# Altium schematic sheet 信号发生器.SchDoc
size B; SheetNumber: 0; SheetTotal: 0
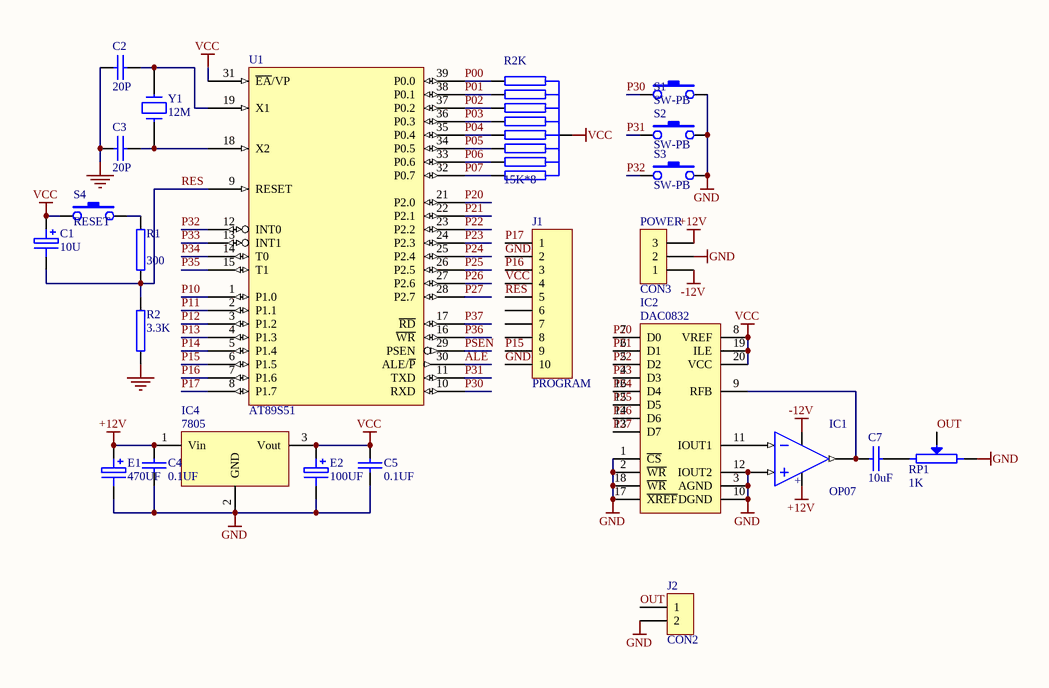
[diagram p0: 信号发生器.SchDoc]

## Parts
C1  10U  [RB.1/.2]
C2  20P  [RAD0.1]
C3  20P  [RAD0.1]
C4  0.1UF  [RAD0.2]
C5  0.1UF  [RAD0.2]
C7  10uF  [RB.1/.2]
E1  470UF  [RB.2/.4]
E2  100UF  [RB.1/.2]
IC1  OP07  [DIP8]
IC2  DAC0832  [DIP20]
IC4  7805  [TO-220V]
J1  PROGRAM  [IDC-10]
J2  CON2
POWER  CON3  [FLY3]
R1  300  [AXIAL0.4]
R2  3.3K  [AXIAL0.4]
R2K  15K*8  [SIP9]
RP1  1K  [VR-B]
S1  SW-PB  [K-B]
S2  SW-PB  [K-B]
S3  SW-PB  [K-B]
S4  RESET  [K-B]
U1  AT89S51  [DIP40P]
Y1  12M  [CY]

## Nets
+12V: C4.1 E1.1 IC1.7 IC4.1(Vin) POWER.3
-12V: IC1.4(-) POWER.1
GND: C2.1 C3.1 C4.2 C5.2 E1.2 E2.2 IC1.3(+IN) IC2.1(~{CS}) IC2.2(~{WR}) IC2.3(AGND) IC2.10(DGND) IC2.12(IOUT2) IC2.17(~{XREF}) IC2.18(~{WR}) IC4.2(GND) J1.2 J1.10 J2.2 POWER.2 R2.2 RP1.2 S1.2 S2.2 S3.2 U1.20(GND)
VCC: C1.1 C5.1 E2.1 IC2.8(VREF) IC2.19(ILE) IC2.20(VCC) IC4.3(Vout) J1.4 R2K.1 S4.1 U1.31(~{EA}/VP) U1.40(VCC)
ALE: U1.30(ALE/~{P})
OUT: J2.1 RP1.3
P00: R2K.2 U1.39(P0.0)
P01: R2K.3 U1.38(P0.1)
P02: R2K.4 U1.37(P0.2)
P03: R2K.5 U1.36(P0.3)
P04: R2K.6 U1.35(P0.4)
P05: R2K.7 U1.34(P0.5)
P06: R2K.8 U1.33(P0.6)
P07: R2K.9 U1.32(P0.7)
P10: U1.1(P1.0)
P11: U1.2(P1.1)
P12: U1.3(P1.2)
P13: U1.4(P1.3)
P14: U1.5(P1.4)
P15: J1.9 U1.6(P1.5)
P16: J1.3 U1.7(P1.6)
P17: J1.1 U1.8(P1.7)
P20: IC2.7(D0) U1.21(P2.0)
P21: IC2.6(D1) U1.22(P2.1)
P22: IC2.5(D2) U1.23(P2.2)
P23: IC2.4(D3) U1.24(P2.3)
P24: IC2.16(D4) U1.25(P2.4)
P25: IC2.15(D5) U1.26(P2.5)
P26: IC2.14(D6) U1.27(P2.6)
P27: IC2.13(D7) U1.28(P2.7)
P30: S1.1 U1.10(RXD)
P31: S2.1 U1.11(TXD)
P32: S3.1 U1.12(INT0)
P33: U1.13(INT1)
P34: U1.14(T0)
P35: U1.15(T1)
P36: U1.16(~{WR})
P37: U1.17(~{RD})
PSEN: U1.29(PSEN)
RES: C1.2 J1.5 R1.2 R2.1 U1.9(RESET)
NetC2_2: C2.2 U1.19(X1) Y1.2
NetC3_2: C3.2 U1.18(X2) Y1.1
NetC7_1: C7.1 RP1.1
NetC7_2: C7.2 IC1.6(OUT) IC2.9(RFB)
NetIC1_2: IC1.2(-IN) IC2.11(IOUT1)
NetR1_1: R1.1 S4.2

Not connected (* = marked no-connect by the designer): J1 6 7 8

## Notes on the sheet
- (in symbol OP07) +

## Library data of the parts
C1 E1 E2 = ELECTRO1: Electrolytic Capacitor
C2-C5 C7 = CAP: Capacitor
IC4 = 7800
J1 = CON10: Connector
J2 = CON2: Connector
POWER = CON3: Connector
R1 R2 = RES2
R2K = RES-8
RP1 = POT2: Potentiometer
S4 = SW-PB
U1 = 87C51FB
Y1 = CRYSTAL